# EAGLE design Servitor32 (EAGLE 6.1)
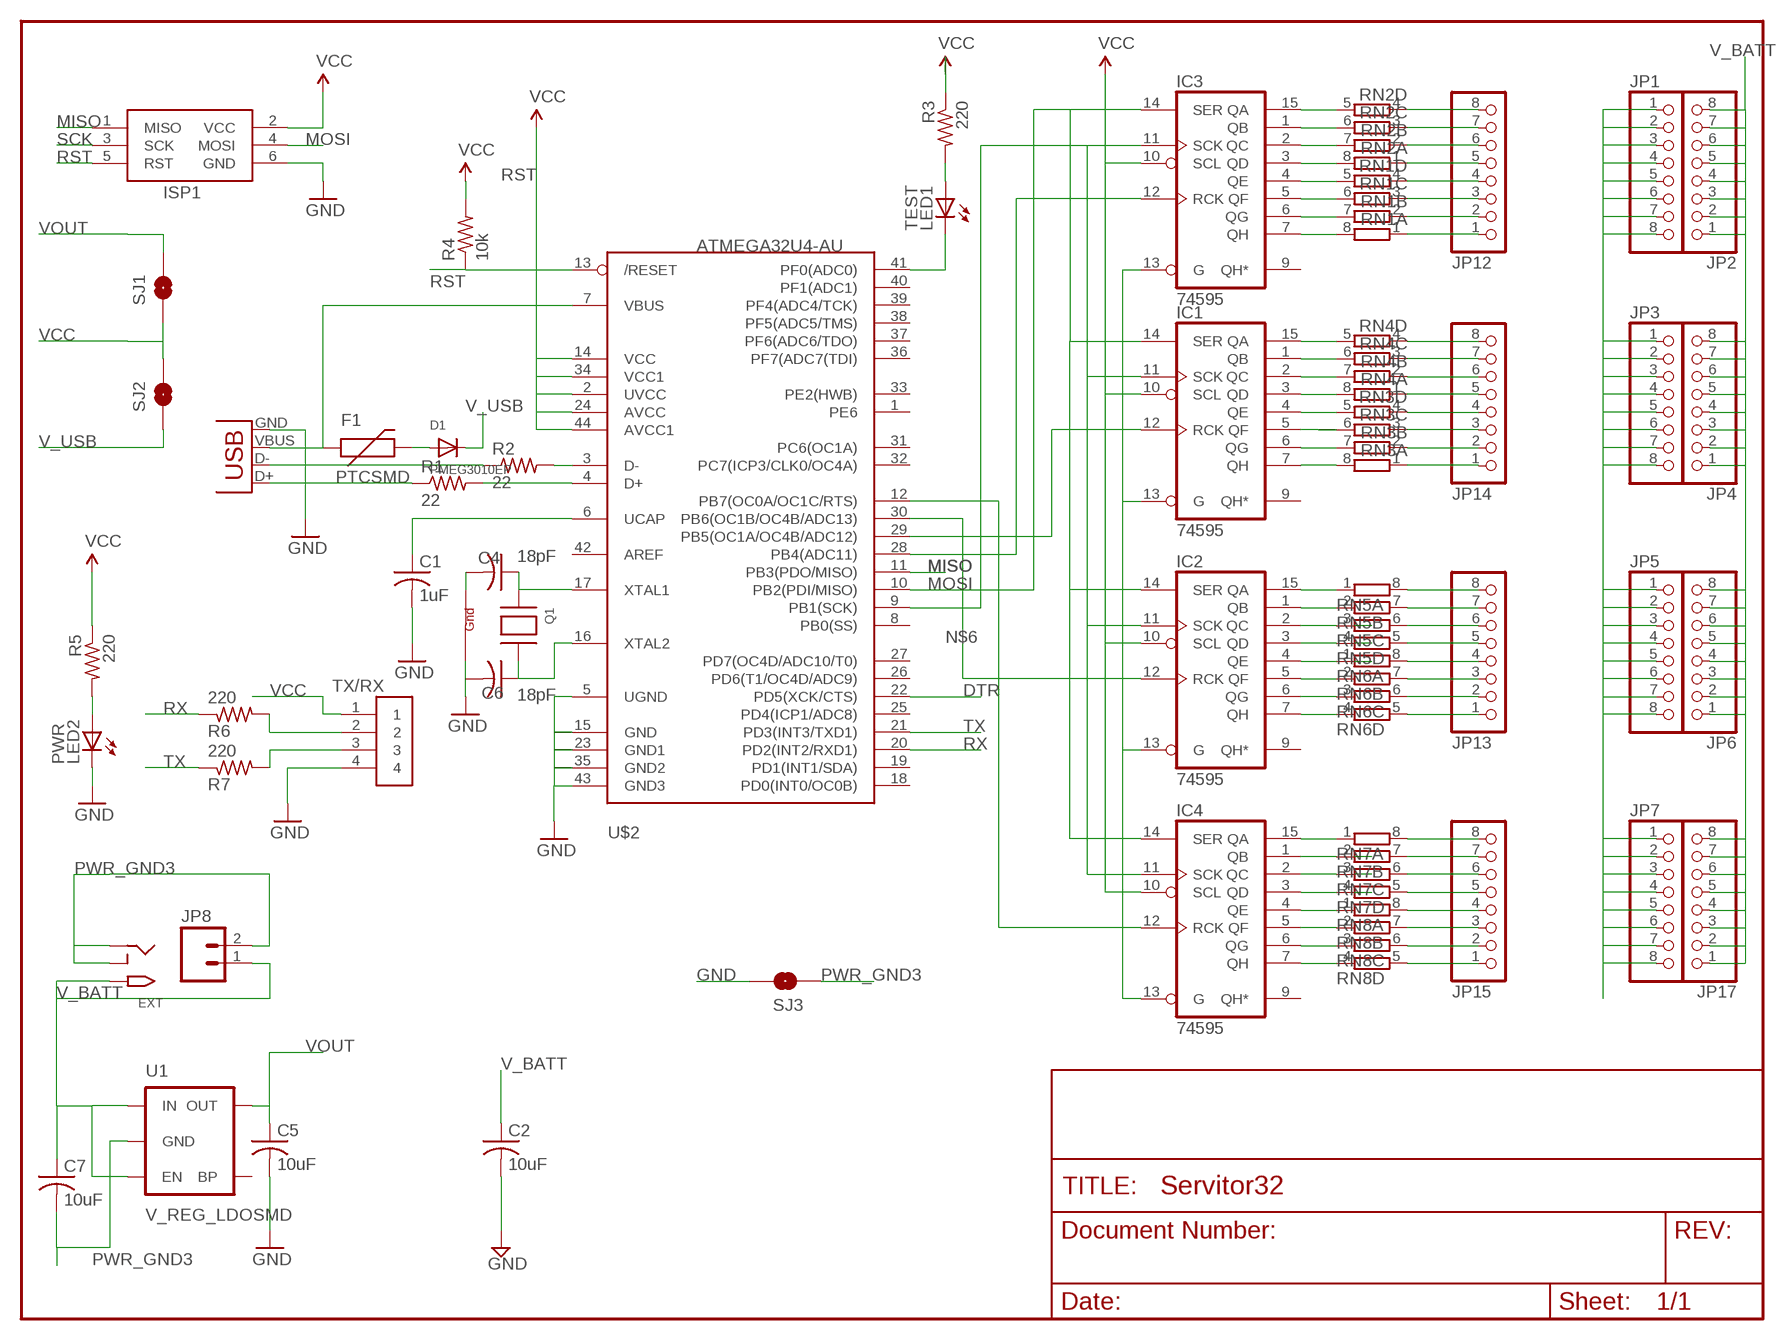
[diagram p0: schematic, sheet 1]

## Parts
C1  1uF  C-USC0805K  [C0805K]
C2  10uF  C-USC0805K  [C0805K]
C4  18pF  C-USC0805K  [C0805K]
C5  10uF  C-USC0805K  [C0805K]
C6  18pF  C-USC0805K  [C0805K]
C7  10uF  C-USC0805  [C0805]
D1  PMEG3010EP  [SOD-128]
EXT  2.1MMJACKTHM  [PJ-102A]
F1  PTCSMD  [PTC-1206]
IC1  74595  [TSSOP16]
IC2  74595  [TSSOP16]
IC3  74595  [TSSOP16]
IC4  74595  [TSSOP16]
ISP1  AVRISP-6  [AVRISP]
JP1  PINHD-1X8CLEANBIG  [1X08-CLEANBIG]
JP2  PINHD-1X8CLEANBIG  [1X08-CLEANBIG]
JP3  PINHD-1X8CLEANBIG  [1X08-CLEANBIG]
JP4  PINHD-1X8CLEANBIG  [1X08-CLEANBIG]
JP5  PINHD-1X8CLEANBIG  [1X08-CLEANBIG]
JP6  PINHD-1X8CLEANBIG  [1X08-CLEANBIG]
JP7  PINHD-1X8CLEANBIG  [1X08-CLEANBIG]
JP8  M023.5MM  [SCREWTERMINAL-3.5MM-2]
JP12  PINHD-1X8CLEANBIG  [1X08-CLEANBIG]
JP13  PINHD-1X8CLEANBIG  [1X08-CLEANBIG]
JP14  PINHD-1X8CLEANBIG  [1X08-CLEANBIG]
JP15  PINHD-1X8CLEANBIG  [1X08-CLEANBIG]
JP17  PINHD-1X8CLEANBIG  [1X08-CLEANBIG]
LED1  TEST  LEDSML0805  [SML0805]
LED2  PWR  LEDSML0805  [SML0805]
Q1  XTAL-4-3225  [NX3225]
R1  22  R-US_R0805  [R0805]
R2  22  R-US_R0805  [R0805]
R3  220  R-US_R0805  [R0805]
R4  10k  R-US_R0805  [R0805]
R5  220  R-US_R0805  [R0805]
R6  220  R-US_R0805  [R0805]
R7  220  R-US_R0805  [R0805]
RN1  4R-NEXB38V  [EXB38V]
RN2  4R-NEXB38V  [EXB38V]
RN3  4R-NEXB38V  [EXB38V]
RN4  4R-NEXB38V  [EXB38V]
RN5  4R-NEXB38V  [EXB38V]
RN6  4R-NEXB38V  [EXB38V]
RN7  4R-NEXB38V  [EXB38V]
RN8  4R-NEXB38V  [EXB38V]
SJ1  SOLDERJUMPER-OLDTRACE  [SJ_2S-TRACE]
SJ2  SOLDERJUMPER-OLDTRACE  [SJ_2S-TRACE]
SJ3  SOLDERJUMPER-OLDTRACE  [SJ_2S-TRACE]
TX/RX  TX/RX  1X4-BIG  [1X04-BIG]
U1  V_REG_LDOSMD  [SOT23-5]
U$2  ATMEGA32U4-AU  [TQFP44]
X1  USBSMD  [USB-MINIB]

## Nets
D+: R1.1 X1.D+
D-: R2.1 X1.D-
DTR: U$2.22(PD5(XCK/CTS))
GND: C1.2 C5.2 C6.2 ISP1.6(GND) LED2.C Q1.4(G2) SJ3.2 TX/RX.4 U$2.5(UGND) U$2.15(GND) U$2.23(GND1) U$2.35(GND2) U$2.43(GND3) X1.GND
MISO: ISP1.1(MISO) U$2.11(PB3(PDO/MISO))
MOSI: IC1.14(SER) IC2.14(SER) IC3.14(SER) IC4.14(SER) ISP1.4(MOSI) U$2.10(PB2(PDI/MISO))
N$1: IC3.15(QA) RN2.5
N$2: LED2.A R5.2
N$3: C4.1 Q1.1(X1) U$2.17(XTAL1)
N$4: R2.2 U$2.3(D-)
N$5: R1.2 U$2.4(D+)
N$6: LED1.C U$2.41(PF0(ADC0))
N$7: LED1.A R3.2
N$8: C4.2 Q1.2(G1)
N$9: C6.1 Q1.3(X2) U$2.16(XTAL2)
N$10: D1.P$2(A) F1.2
N$11: IC3.1(QB) RN2.6
N$12: IC1.15(QA) RN4.5
N$13: IC3.2(QC) RN2.7
N$14: IC3.3(QD) RN2.8
N$16: C1.1 U$2.6(UCAP)
N$17: IC3.4(QE) RN1.5
N$18: IC3.5(QF) RN1.6
N$19: IC3.6(QG) RN1.7
N$20: IC3.7(QH) RN1.8
N$21: JP12.8 RN2.4
N$22: JP12.7 RN2.3
N$23: JP12.6 RN2.2
N$24: JP12.5 RN2.1
N$25: JP12.4 RN1.4
N$26: JP12.3 RN1.3
N$27: JP12.2 RN1.2
N$28: IC1.1(QB) RN4.6
N$29: IC1.2(QC) RN4.7
N$30: IC1.3(QD) RN4.8
N$31: IC1.4(QE) RN3.5
N$32: IC1.5(QF) RN3.6
N$33: IC1.6(QG) RN3.7
N$34: IC1.7(QH) RN3.8
N$35: IC2.15(QA) RN5.1
N$36: IC2.1(QB) RN5.2
N$37: IC2.3(QD) RN5.4
N$38: IC2.4(QE) RN6.1
N$39: IC2.5(QF) RN6.2
N$40: IC2.6(QG) RN6.3
N$41: IC2.7(QH) RN6.4
N$42: IC4.7(QH) RN8.4
N$43: IC4.15(QA) RN7.1
N$44: IC4.2(QC) RN7.3
N$45: IC4.3(QD) RN7.4
N$46: IC4.4(QE) RN8.1
N$47: IC4.5(QF) RN8.2
N$48: IC4.6(QG) RN8.3
N$49: IC2.2(QC) RN5.3
N$50: IC4.1(QB) RN7.2
N$51: JP12.1 RN1.1
N$52: JP14.8 RN4.4
N$53: JP14.7 RN4.3
N$54: JP14.6 RN4.2
N$55: JP14.5 RN4.1
N$57: JP14.4 RN3.4
N$58: JP14.3 RN3.3
N$59: JP14.2 RN3.2
N$60: JP13.8 RN5.8
N$61: JP13.7 RN5.7
N$62: JP13.5 RN5.5
N$63: JP13.4 RN6.8
N$64: JP13.3 RN6.7
N$65: JP13.2 RN6.6
N$66: JP13.1 RN6.5
N$67: JP15.1 RN8.5
N$68: JP15.8 RN7.8
N$69: JP15.6 RN7.6
N$70: JP15.5 RN7.5
N$71: JP15.4 RN8.8
N$72: JP15.3 RN8.7
N$73: JP15.2 RN8.6
N$74: JP13.6 RN5.6
N$75: JP15.7 RN7.7
N$76: JP14.1 RN3.1
N$90: R7.2 TX/RX.3
N$91: R6.2 TX/RX.2
PB4: IC3.12(RCK) U$2.28(PB4(ADC11))
PB5: IC1.12(RCK) U$2.29(PB5(OC1A/OC4B/ADC12))
PB6: IC2.12(RCK) U$2.30(PB6(OC1B/OC4B/ADC13))
PB7: IC4.12(RCK) U$2.12(PB7(OC0A/OC1C/RTS))
PWR_GND3: C2.2 C7.2 EXT.RING EXT.RING_SW IC1.13(G) IC2.13(G) IC3.13(G) IC4.13(G) JP1.1 JP1.2 JP1.3 JP1.4 JP1.5 JP1.6 JP1.7 JP1.8 JP3.1 JP3.2 JP3.3 JP3.4 JP3.5 JP3.6 JP3.7 JP3.8 JP5.1 JP5.2 JP5.3 JP5.4 JP5.5 JP5.6 JP5.7 JP5.8 JP7.1 JP7.2 JP7.3 JP7.4 JP7.5 JP7.6 JP7.7 JP7.8 JP8.2 SJ3.1 U1.2(GND) ; supply symbol labelled GND
RST: ISP1.5(RST) R4.1 U$2.13(/RESET)
RX: R6.1 U$2.20(PD2(INT2/RXD1))
SCK: IC1.11(SCK) IC2.11(SCK) IC3.11(SCK) IC4.11(SCK) ISP1.3(SCK) U$2.9(PB1(SCK))
TX: R7.1 U$2.21(PD3(INT3/TXD1))
V_BATT: C2.1 C7.1 EXT.TIP JP2.1 JP2.2 JP2.3 JP2.4 JP2.5 JP2.6 JP2.7 JP2.8 JP4.1 JP4.2 JP4.3 JP4.4 JP4.5 JP4.6 JP4.7 JP4.8 JP6.1 JP6.2 JP6.3 JP6.4 JP6.5 JP6.6 JP6.7 JP6.8 JP8.1 JP17.1 JP17.2 JP17.3 JP17.4 JP17.5 JP17.6 JP17.7 JP17.8 U1.1(IN) U1.3(EN)
V_USB: D1.P$1(C) SJ2.1
VBUS: F1.1 U$2.7(VBUS) X1.VBUS
VCC: IC1.10(SCL) IC2.10(SCL) IC3.10(SCL) IC4.10(SCL) ISP1.2(VCC) R3.1 R4.2 R5.1 SJ1.1 SJ2.2 TX/RX.1 U$2.2(UVCC) U$2.14(VCC) U$2.24(AVCC) U$2.34(VCC1) U$2.44(AVCC1)
VOUT: C5.1 SJ1.2 U1.5(OUT)
Unconnected: IC1.9(QH*) IC2.9(QH*) IC3.9(QH*) IC4.9(QH*) U1.4(BP) U$2.1(PE6) U$2.8(PB0(SS)) U$2.18(PD0(INT0/OC0B)) U$2.19(PD1(INT1/SDA)) U$2.25(PD4(ICP1/ADC8)) U$2.26(PD6(T1/OC4D/ADC9)) U$2.27(PD7(OC4D/ADC10/T0)) U$2.31(PC6(OC1A)) U$2.32(PC7(ICP3/CLK0/OC4A)) U$2.33(PE2(HWB)) U$2.36(PF7(ADC7(TDI)) U$2.37(PF6(ADC6/TDO)) U$2.38(PF5(ADC5/TMS)) U$2.39(PF4(ADC4/TCK)) U$2.40(PF1(ADC1)) U$2.42(AREF)

## Power pins joined to a net without a drawn wire
GND: IC1.8(GND) IC2.8(GND) IC3.8(GND) IC4.8(GND)
VCC: IC1.16(VCC) IC2.16(VCC) IC3.16(VCC) IC4.16(VCC)

## Library data of the parts
C1 C2 C4-C7 = rcl:C-US: CAPACITOR, American symbol
D1 = arcbotics:PMEG3010EP
EXT = adafruit:2.1MMJACK: 2.1mm x 5.5mm THM DC jack with internal switch. Digikey part #PJ-102A, 4UCON part #05537 2.1mm x 5.5mm SMT DC jack with internal switch. Digikey part #PJ-002A-SMT, 4UCON part #03267 By microbuilder.eu & adafruit.com
F1 = SparkFun:PTC: Resettable Fuse PTC Resettable Fuse. Spark Fun Electronics SKU : COM-08357
IC1-IC4 = arcbotics:74*595: 8-bit SHIFT REGISTER, output latch
ISP1 = adafruit:AVRISP: AVR ISP HEADER Standard 6 pin header for AVR programming
JP1-JP7 JP12-JP15 JP17 = adafruit:PINHD-1X8: PIN HEADER
JP8 = SparkFun:M02: Header 2 Standard 2-pin 0.1" header. Use with straight break away headers (SKU : PRT-00116), right angle break away headers (PRT-00553), swiss pins (PRT-00743), machine pins (PRT-00117), and female headers (PRT-00115). Molex polarized connector foot print use with SKU : PRT-08233 with associated crimp pins and housings.
LED1 LED2 = led:LED: LED OSRAM: - CHIPLED LG R971, LG N971, LY N971, LG Q971, LY Q971, LO R971, LY R971 LH N974, LH R974 LS Q976, LO Q976, LY Q976 LO Q996 - Hyper CHIPLED LW Q18S LB Q993, LB Q99A, LB R99A - SideLED LS A670, LO A670, LY A670, LG A670, LP A670 LB A673, LV A673, LT A673, LW A673 LH A674 LY A675 LS A676, LA A676, LO A676, LY A676, LW A676 LS A679, LY A679, LG A679 - Hyper Micro SIDELED® LS Y876, LA Y876, LO Y876, LY Y876 LT Y87S - SmartLED LW L88C, LW L88S LB L89C, LB L89S, LG L890 LS L89K, LO L89K, LY L89K LS L896, LA L896, LO L896, LY L896 - TOPLED LS T670, LO T670, LY T670, LG T670, LP T670 LSG T670, LSP T670, LSY T670, LOP T670, LYG T670 LG T671, LOG T671, LSG T671 LB T673, LV T673, LT T673, LW T673 LH T674 LS T676, LA T676, LO T676, LY T676, LB T676, LH T676, LSB T676, LW T676 LB T67C, LV T67C, LT T67C, LS T67K, LO T67K, LY T67K, LW E67C LS E67B, LA E67B, LO E67B, LY E67B, LB E67C, LV E67C, LT E67C LW T67C LS T679, LY T679, LG T679 LS T770, LO T770, LY T770, LG T770, LP T770 LB T773, LV T773, LT T773, LW T773 LH T774 LS E675, LA E675, LY E675, LS T675 LS T776, LA T776, LO T776, LY T776, LB T776 LHGB T686 LT T68C, LB T68C - Hyper Mini TOPLED® LB M676 - Mini TOPLED Santana® LG M470 LS M47K, LO M47K, LY M47K Source: http://www.osram.convergy.de LUXEON: - LUMILED® LXK2-PW12-R00, LXK2-PW12-S00, LXK2-PW14-U00, LXK2-PW14-V00 LXK2-PM12-R00, LXK2-PM12-S00, LXK2-PM14-U00 LXK2-PE12-Q00, LXK2-PE12-R00, LXK2-PE12-S00, LXK2-PE14-T00, LXK2-PE14-U00 LXK2-PB12-K00, LXK2-PB12-L00, LXK2-PB12-M00, LXK2-PB14-N00, LXK2-PB14-P00, LXK2-PB14-Q00 LXK2-PR12-L00, LXK2-PR12-M00, LXK2-PR14-Q00, LXK2-PR14-R00 LXK2-PD12-Q00, LXK2-PD12-R00, LXK2-PD12-S00 LXK2-PH12-R00, LXK2-PH12-S00 LXK2-PL12-P00, LXK2-PL12-Q00, LXK2-PL12-R00 Source: www.luxeon.com KINGBRIGHT: KA-3528ASYC Source: www.kingbright.com
Q1 = adafruit:XTAL-4: Classic 4-pin 3.2 x 2.5mm crystal
R1 R2 R4 = rcl:R-US_: RESISTOR, American symbol
R3 R5-R7 = resistor:R-US_: RESISTOR, American symbol
RN1-RN8 = resistor-dil:4R-N: Array Chip Resistor Source: RS Component / Phycomp; OC_FARNELL: unknown; OC_NEWARK: unknown
SJ1-SJ3 = SparkFun:SOLDERJUMPER-OLD: Solder Jumper Standard SMD solder jumper. Used to automate production. Two varients : Normally Open and Normally Closed are the same, but have different paste layers. NC will have a large amount of paste and should jumper during reflow.
TX/RX = adafruit:1X4: 4-pin connector
U1 = SparkFun:V_REG_LDO: Voltage Regulator LDO Standard 150mA LDO voltage regulator in SOT-23 layout. Micrel part MIC5205. BP (by-pass) pin is used to lower output noise with 470pF cap.
U$2 = adafruit:ATMEGA32U4: http://www.ladyada.net/library/eagle
X1 = SparkFun:USB: USB Connectors USB-B-PTH is fully proven SKU : PRT-00139 USB-miniB is fully proven SKU : PRT-00587 USB-A-PCB is untested. USB-A-H is throughly reviewed, but untested. Spark Fun Electronics SKU : PRT-00437 USB-B-SMT is throughly reviewed, but untested. Needs silkscreen touching up. USB-A-S has not been used/tested USB-MB-H has not been used/tested

## Board
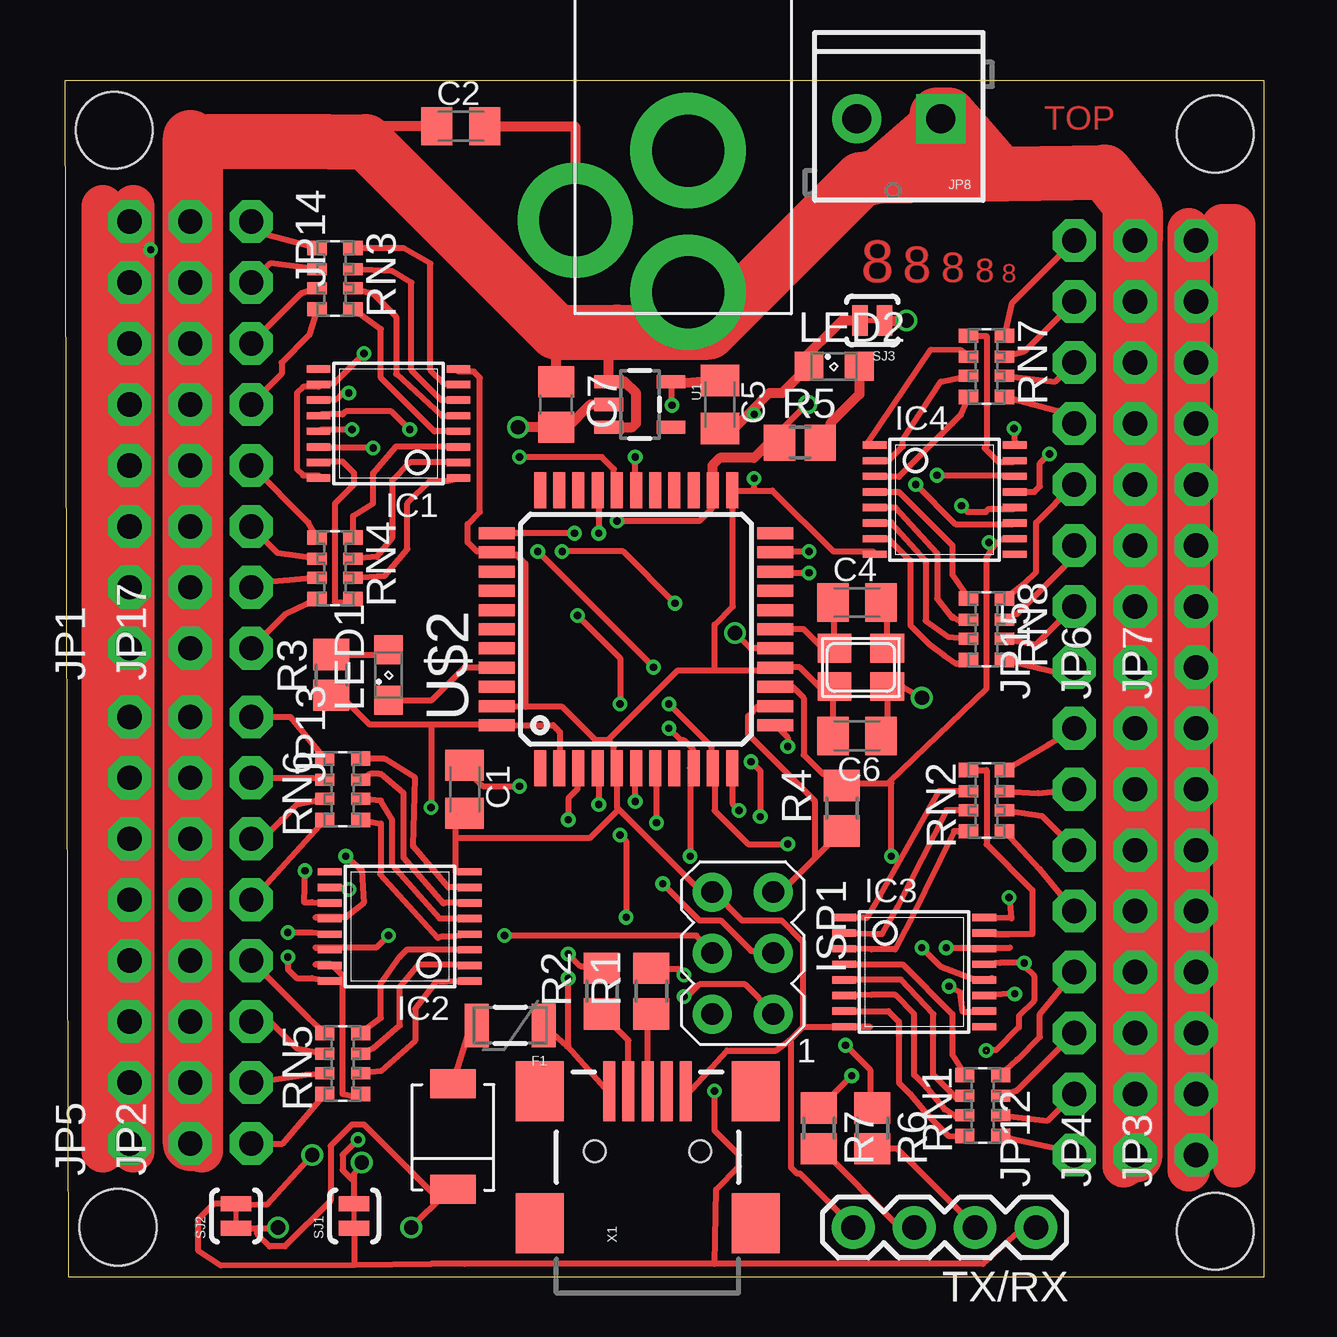
[diagram p1: board, top side]
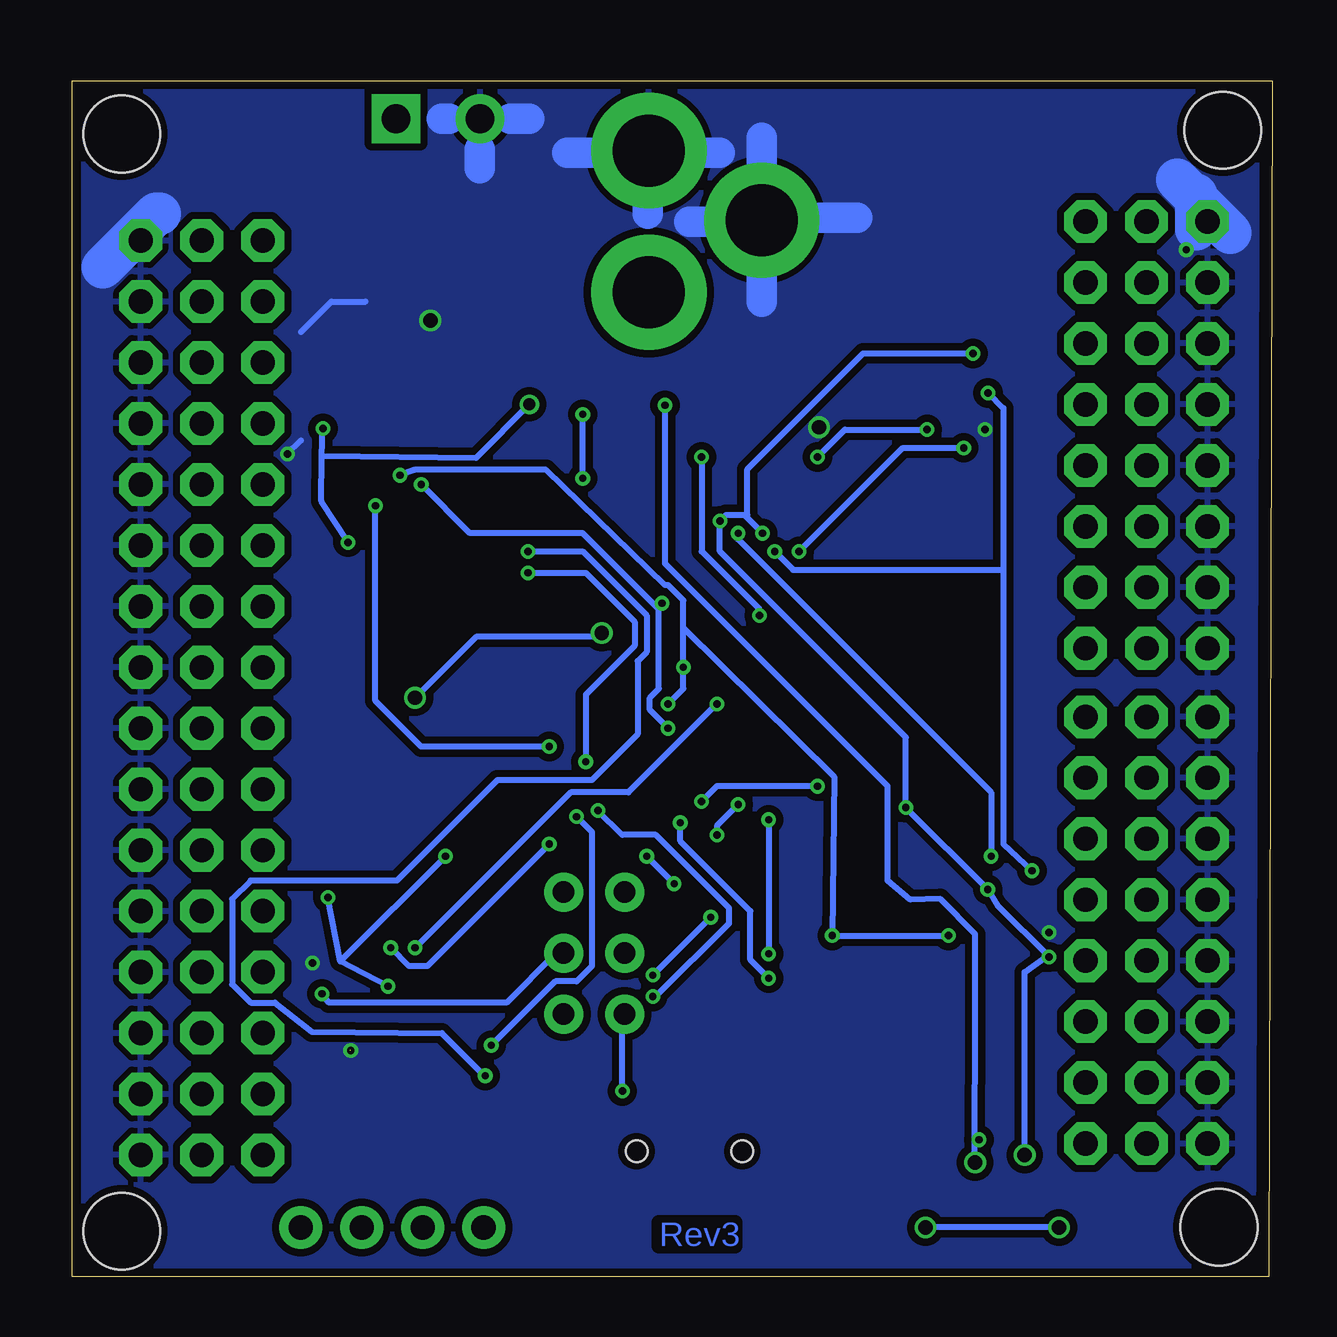
[diagram p2: board, bottom side, seen from below]

Size 49.99 x 49.84 mm. Coordinates in mm from the lower left corner, seen from the top.
Outline: 0.16,0 49.99,0 49.99,49.84 0,49.84 0.16,0
Copper layers (1*16): Top 0.035mm / dielectric 1.5mm / Bottom 0.035mm
Design rules: minimum track width 10mil, minimum drill 12mil, track to track 7mil, track to pad 7mil, pad to pad 7mil, via to via 7mil, smd to smd 0mil, copper to edge 10mil, drill to drill 10mil, minimum pad ring 10mil, minimum via ring 6mil, stop-mask expansion 2mil, vias tented up to drill 100mil, thermal gap 10mil
Holes 3.2 mm at 2.06,47.78 2.22,2.06 47.94,47.62 47.94,1.91

### Footprints (pad centres in the part's own frame; a part is rotated, then mirrored left to right if it is on the bottom)
C0805K = smd 1.3 x 1.6: 1 -1,0; 2 1,0
C0805 = smd 1.3 x 1.5: 1 -0.95,0; 2 0.95,0
SOD-128 = smd 1.2 x 1.9: P$1 -2.223,0.016; P$2 2.179,0.016
PJ-102A = drill 3 pad 4.8: RING 0.1,-3.39; RING_SW -4.6,-6.29; TIP 0.1,-9.29
PTC-1206 = smd 1 x 1.8: 1 -1.4,0; 2 1.4,0
TSSOP16 = smd 0.305 x 0.991: 1 -2.275,-2.918; 2 -1.625,-2.918; 3 -0.975,-2.918; 4 -0.325,-2.918; 5 0.325,-2.918; 6 0.975,-2.918; 7 1.625,-2.918; 8 2.275,-2.918; 9 2.275,2.918; 10 1.625,2.918; 11 0.975,2.918; 12 0.325,2.918; 13 -0.325,2.918; 14 -0.975,2.918; 15 -1.625,2.918; 16 -2.275,2.918
AVRISP = drill 0.9 pad 1.626: 1 -1.27,2.54; 2 1.27,2.54; 3 -1.27,0; 4 1.27,0; 5 -1.27,-2.54; 6 1.27,-2.54
1X08-CLEANBIG = drill 1.016 pad 1.778 octagon: 1 -8.89,0; 2 -6.35,0; 3 -3.81,0; 4 -1.27,0; 5 1.27,0; 6 3.81,0; 7 6.35,0; 8 8.89,0
SCREWTERMINAL-3.5MM-2 = drill 1.2 pad 2.032 square: 1 0,0 | drill 1.2 pad 2.032: 2 3.5,0
SML0805 = smd 1.2 x 1.2: A 1.05,0; C -1.05,0
NX3225 = smd 1.4 x 1.2: 1 -1.1,0.8; 2 1.1,0.8; 3 1.1,-0.8; 4 -1.1,-0.8
R0805 = smd 1.3 x 1.5: 1 -0.95,0; 2 0.95,0
R0805' = smd 1.3 x 1.5: 1 -0.85,0; 2 0.85,0
EXB38V = smd 0.6 x 0.8: 1 -1.275,-0.75; 4 1.275,-0.75; 5 1.275,0.75; 8 -1.275,0.75 | smd 0.5 x 0.8: 2 -0.4,-0.75; 3 0.4,-0.75; 6 0.4,0.75; 7 -0.4,0.75
SJ_2S-TRACE = smd 0.635 x 1.27: 1 -0.508,0; 2 0.508,0
1X04-BIG = drill 1.016 pad 1.778: 1 0,0; 2 2.54,0; 3 5.08,0; 4 7.62,0
SOT23-5 = smd 0.55 x 1.2: 1 -0.95,-1.3; 2 0,-1.3; 3 0.95,-1.3; 4 0.95,1.3; 5 -0.95,1.3
TQFP44 = smd 1.5 x 0.5: 1 -5.8,4; 2 -5.8,3.2; 3 -5.8,2.4; 4 -5.8,1.6; 5 -5.8,0.8; 6 -5.8,0; 7 -5.8,-0.8; 8 -5.8,-1.6; 9 -5.8,-2.4; 10 -5.8,-3.2; 11 -5.8,-4; 23 5.8,-4; 24 5.8,-3.2; 25 5.8,-2.4; 26 5.8,-1.6; 27 5.8,-0.8; 28 5.8,0; 29 5.8,0.8; 30 5.8,1.6; 31 5.8,2.4; 32 5.8,3.2; 33 5.8,4 | smd 0.5 x 1.5: 12 -4,-5.8; 13 -3.2,-5.8; 14 -2.4,-5.8; 15 -1.6,-5.8; 16 -0.8,-5.8; 17 0,-5.8; 18 0.8,-5.8; 19 1.6,-5.8; 20 2.4,-5.8; 21 3.2,-5.8; 22 4,-5.8; 34 4,5.8; 35 3.2,5.8; 36 2.4,5.8; 37 1.6,5.8; 38 0.8,5.8; 39 0,5.8; 40 -0.8,5.8; 41 -1.6,5.8; 42 -2.4,5.8; 43 -3.2,5.8; 44 -4,5.8
USB-MINIB = smd 2.5 x 0.5: D+ 2.5,0; D- 2.5,0.8; GND 2.5,-1.6; ID 2.5,-0.8; VBUS 2.5,1.6 | smd 2.5 x 2: MTN1 -3,4.5; MTN2 2.5,4.5; MTN3 -3,-4.5; MTN4 2.5,-4.5 | hole 0.9: 0,2.2; 0,-2.2

### Placement (x,y rotation side)
C1  16.67,20.32 270 top
C2  16.51,47.94 0 top
C4  33.02,28.1 0 top
C5  27.3,36.35 270 top
C6  33.02,22.54 180 top
C7  20.48,36.35 270 top
D1  16.19,5.87 90 top
EXT  25.88,50.32 0 top
F1  18.57,10.48 180 top
IC1  13.49,35.56 90 top
IC2  13.97,14.61 90 top
IC3  35.4,12.7 270 top
IC4  36.67,32.38 270 top
ISP1  28.26,13.49 180 top
JP1  2.7,35.08 90 top
JP2  5.24,14.45 90 top
JP3  47.15,13.97 90 top
JP4  44.61,13.97 90 top
JP5  2.7,14.45 90 top
JP6  44.61,34.29 90 top
JP7  47.15,34.29 90 top
JP8  36.51,48.26 180 top
JP12  42.07,13.97 90 top
JP13  7.78,14.45 270 top
JP14  7.78,35.08 270 top
JP15  42.07,34.29 90 top
JP17  5.24,35.08 90 top
LED1  13.49,25.08 90 top
LED2  32.07,37.94 0 top
Q1  33.18,25.4 0 top
R1  24.45,11.91 90 top
R2  22.38,11.91 90 top
R3  220  [R0805']  11.11,25.08 90 top
R4  32.38,19.53 90 top
R5  220  [R0805']  30.64,34.77 0 top
R6  220  [R0805']  33.66,6.19 270 top
R7  220  [R0805']  31.43,6.19 270 top
RN1  38.26,7.14 90 top
RN2  38.42,19.84 90 top
RN3  11.27,41.59 270 top
RN4  11.27,29.53 270 top
RN5  11.59,8.89 90 top
RN6  11.59,20.32 90 top
RN7  38.42,37.94 270 top
RN8  38.42,26.99 270 top
SJ1  12.06,2.54 90 top
SJ2  7.14,2.54 90 top
SJ3  33.66,39.85 180 top
TX/RX  40.48,2.06 180 top
U1  23.97,36.35 270 top
U$2  23.81,26.99 90 top
X1  24.29,5.24 90 top

### Tracks (layer width: path | path; a pad name or v marks a point on that pad's centre or on a via)
D+
  Top 0.254: X1.D+ 24.29,10.8 R1.1
D-
  Top 0.254: X1.D- 23.49,9.85 R2.1
GND  (via drill 0.3)
  Top 0.254: C6.2 32.02,24.54 Q1.4 31.44,24.6 30.64,25.4 29.62,25.4 U$2.15 29.5,25.27 27.08,25.27 | 30.77,10.41 33.56,10.41 IC3.8 | 30.19,9.84 29.62,9.43 27.59,9.43 25.94,7.62 X1.GND | 30.19,9.84 30.77,10.41 | TX/RX.4 32.8,2.16 30.64,4.32 30.51,4.32 30.26,4.57 30.26,9.78 30.19,9.84 | 30.77,38.23 30.89,38.1 LED2.C | 28.73,32.77 27.84,32.77 U$2.23 27.84,32.64 27.84,27.94 27.08,27.18 27.08,25.27 | 28.73,32.77 29.5,32.77 32.04,30.23 33.69,30.23 IC4.8 | 28.73,32.77 v28.73,33.27 | v28.73,35.94 28.61,36.07 | IC1.8 16.41,37.72 17.05,37.72 17.3,37.47 17.3,31.88 16.8,31.37 16.8,30.61 17.18,30.23 17.94,30.23 U$2.35 18.07,30.1 18.83,30.1 19.21,29.72 19.21,23.75 | 16.29,18.29 16.29,18.92 16.67,19.3 C1.2 | 16.29,18.29 16.29,16.89 IC2.8 | 23.08,19.49 26.45,16.13 26.96,16.13 ISP1.6 27.08,16 28.23,14.86 29.88,14.86 30.77,13.97 30.77,10.41 | 23.08,19.49 23.02,19.56 23.02,21.08 U$2.5 22.89,21.21 22.89,22.1 22.64,22.35 | 19.21,23.75 20.73,23.75 22.13,22.35 22.64,22.35 | 19.21,23.75 18.07,23.75 U$2.43 | 16.29,18.29 21.88,18.29 23.02,19.43 23.08,19.49 | 27.08,25.27 25.56,25.27 22.64,22.35 | 32.29,39.75 32.17,39.63
  Top 0.406: 32.17,39.63 30.77,38.23 30.64,38.1 | C5.2 27.73,35.2 28.61,36.07 29.37,36.83 29.91,36.83 LED2.C | SJ3.2 32.38,39.85 32.29,39.75 32.23,39.69
  Bottom 0.254: v28.73,33.27 v28.73,35.94
MISO  (via drill 0.3)
  Top 0.254: v28.1,19.43 27.84,19.68 27.84,21.08 U$2.11 | v25.81,11.68 25.94,11.68 26.45,12.19 28.35,12.19 29.5,11.05 ISP1.1
  Bottom 0.254: v28.1,19.43 27.08,18.41 25.69,18.41 22.64,15.37 22.64,14.73 25.69,11.68 v25.81,11.68
MOSI  (via drill 0.3)
  Top 0.254: v13.49,14.22 12.99,13.72 10.45,13.72 IC2.14 | v18.34,14.22 26.32,14.22 26.96,13.59 ISP1.4 | v12.86,34.54 10.7,34.54 IC1.14 | v24.54,25.4 v19.72,30.23 | v25.18,23.88 26.96,22.1 26.96,21.21 U$2.10 27.08,21.08 27.08,19.43 28.48,18.03 v30.13,18.03 | v36.73,13.72 39.4,13.72 IC3.14 | v36.35,33.4 39.53,33.4 IC4.14
  Bottom 0.254: v13.49,14.22 v18.34,14.22 18.26,20.84 24.54,27.05 | v12.86,34.54 15.4,34.54 v19.72,30.23 | v25.18,23.88 24.54,24.51 v24.54,25.4 24.54,27.05 | v36.73,13.72 35.97,12.95 35.21,12.95 v30.13,18.03 | v36.35,33.4 35.73,33.62 30.26,33.62 25.3,28.83 25.18,28.83 24.54,28.19 24.54,27.05
N$1
  Top 0.254: RN2.5 37.78,21.11 38.42,21.11 38.42,18.02 40.32,16.11 40.32,14.29 38.73,14.29 39.39,14.29 IC3.15
N$2
  Top 0.254: R5.2 31.53,34.8 31.78,34.8 31.91,34.8
  Top 0.406: LED2.A 33.12,36.77 31.91,35.56 31.91,34.8 31.91,34.29
N$3
  Top 0.254: C4.1 32.08,28.04 Q1.1 31.58,26.2 30.8,26.99 U$2.17
N$4  (via drill 0.3)
  Top 0.254: v20.99,13.46 21.49,12.95 22.38,12.95 R2.2 | v20.99,19.05 20.99,19.94 21.37,20.32 21.37,21.08 U$2.3
  Bottom 0.254: v20.99,19.05 v20.99,13.46
N$5  (via drill 0.3)
  Top 0.254: v25.81,12.57 25.56,12.83 24.54,12.83 R1.2 | v23.4,14.99 23.4,18.16 v23.15,18.41 | v22.26,19.68 22.26,21.08 U$2.4
  Bottom 0.254: v23.4,14.99 v25.81,12.57 | v23.15,18.41 23.15,18.8 v22.26,19.68
N$6
  Top 0.254: LED1.C 15.3,24.03 16.67,25.4 17.94,25.4 U$2.41
N$7
  Top 0.254: R3.2 13.07,25.93 13.33,26.19 13.37,26.16 13.49,26.16 LED1.A
N$8
  Top 0.254: Q1.2 34.28,27.84 C4.2
N$9  (via drill 0.6)
  Top 0.254: C6.1 34.28,22.8 Q1.3 34.92,24.6 v35.72,24.13 | U$2.16 28.58,26.19 v27.94,26.83
  Bottom 0.254: v35.72,24.13 33.18,26.67 28.1,26.67 27.97,26.8 v27.94,26.83
N$10
  Top 0.254: D1.P$2 16.81,10.12 F1.2
N$11
  Top 0.254: RN2.6 36.43,20.24 33.97,15.88 33.42,14.96 IC3.1
N$12
  Top 0.254: RN4.5 12.06,28.26 11.59,28.1 11.27,28.1 11.27,32.23 12.06,33.02 12.06,33.5 11.59,33.97 10.61,33.97 IC1.15
N$13
  Top 0.254: RN2.7 36.75,19.45 34.69,15.4 34.37,14.84 34.05,14.29 33.63,14.29 IC3.2
N$14
  Top 0.254: RN2.8 37.22,18.57 37.07,18.57 35.24,14.84 34.61,13.65 33.62,13.65 IC3.3
N$16  (via drill 0.3)
  Top 0.254: v23.78,19.81 23.78,21.08 U$2.6 | v18.95,20.45 17.43,20.45 16.67,21.21 C1.1
  Bottom 0.254: v23.78,19.81 23.15,20.45 v18.95,20.45
N$17
  Top 0.254: IC3.4 34.92,13.03 36.99,10.95 36.99,9.25 RN1.5
N$18
  Top 0.254: RN1.6 37.15,7.46 36.19,8.41 36.19,10.95 34.85,12.38 33.67,12.38 IC3.5
N$19
  Top 0.254: RN1.7 37.15,6.67 36.67,6.99 35.88,7.94 35.4,8.41 35.4,10.95 34.61,11.75 33.62,11.75 IC3.6
N$20
  Top 0.254: IC3.7 34.33,11.07 34.77,10.64 34.77,8.1 35.24,7.62 36.04,6.67 36.83,5.87 RN1.8
N$21
  Top 0.254: RN2.4 41,22.18 JP12.8
N$22
  Top 0.254: RN2.3 40.56,20.16 JP12.7
N$23
  Top 0.254: RN2.2 40.72,19.21 42.07,17.86 JP12.6
N$24
  Top 0.254: RN2.1 40.64,16.99 JP12.5
N$25
  Top 0.254: RN1.4 39.69,9.05 40.64,10 40.64,10.95 JP12.4
N$26
  Top 0.254: RN1.3 39.69,7.78 JP12.3
N$27
  Top 0.254: RN1.2 40.96,6.51 JP12.2
N$28
  Top 0.254: RN4.6 13.33,29.21 14.29,30.32 14.29,32.23 15.24,33.18 15.99,33.18 IC1.1
N$29
  Top 0.254: IC1.2 14.41,33.94 13.65,33.18 13.65,30.8 13.02,30 RN4.7
N$30
  Top 0.254: RN4.8 12.02,31.71 12.86,32.23 12.86,33.5 13.81,34.61 16.28,34.61 IC1.3
N$31
  Top 0.254: IC1.4 15.41,35.23 13.18,37.47 13.18,39.49 RN3.5
N$32
  Top 0.254: RN3.6 12.86,40.96 13.81,40.01 13.81,37.62 15.72,35.88 16.25,35.88 IC1.5
N$33
  Top 0.254: IC1.6 15.69,36.53 14.45,37.78 14.45,41.43 13.65,41.91 RN3.7
N$34
  Top 0.254: IC1.7 15.84,37.19 15.24,37.78 15.24,42.23 14.13,42.86 RN3.8
N$35
  Top 0.254: RN5.1 12.22,7.46 11.59,7.62 11.59,12.54 11.11,13.02 10.45,13.02 IC2.15
N$36
  Top 0.254: IC2.1 15.46,12.28 14.6,11.17 14.6,9.84 13.18,8.57 RN5.2
N$37
  Top 0.254: RN5.4 13.18,10.79 13.18,12.22 13.97,13.34 14.29,13.65 16.23,13.65 IC2.3
N$38
  Top 0.254: RN6.1 13.18,18.89 13.18,16.87 13.13,16.79 15.56,14.13 15.78,14.19 16.16,14.19 IC2.4
N$39
  Top 0.254: IC2.5 15.63,14.93 13.65,17.14 13.65,19.05 13.18,19.84 RN6.2
N$40
  Top 0.254: IC2.6 15.85,15.58 15.8,15.56 14.13,17.46 14.13,20.16 13.18,20.95 13.11,20.95 12.73,20.95 RN6.3
N$41
  Top 0.254: IC2.7 16,16.23 14.53,17.94 14.6,20.8 13.33,21.59 RN6.4
N$42
  Top 0.254: IC4.7 34.33,30.76 35.24,29.84 35.24,29.69 35.24,27.15 36.04,26.35 36.67,25.88 37.15,25.56 37.19,25.56 RN8.4
N$43
  Top 0.254: RN7.1 37.78,39.21 38.42,39.21 38.42,34.61 38.39,34.54 38.35,34.51 | IC4.15 39.55,33.97 38.89,33.97 38.35,34.51 | 38.35,34.51 38.34,34.53
N$44
  Top 0.254: IC4.2 34.33,34.01 34.92,34.61 34.92,34.88 36.51,37.31 RN7.3
N$45
  Top 0.254: RN7.4 37.35,35.92 36.99,35.56 34.77,33.34 33.78,33.34 IC4.3
N$46
  Top 0.254: IC4.4 34.76,32.71 36.99,30.48 36.99,29.25 RN8.1
N$47
  Top 0.254: IC4.5 34.61,32.06 36.35,30.16 36.35,28.26 36.96,27.5 | 36.96,27.5 36.99,27.46 | RN8.2 37.24,27.37 36.99,27.53 36.96,27.5
N$48
  Top 0.254: IC4.6 34.15,31.41 34.29,31.41 34.45,31.43 35.88,29.84 35.88,27.35 36.83,26.67 RN8.3
N$49
  Top 0.254: RN5.3 12.86,9.53 13.97,10.48 13.97,12.06 14.76,13.02 15.72,13.02 16.22,13.02 IC2.2
N$50
  Top 0.254: IC4.1 33.44,34.71 36.08,38.62 37.37,38.61 RN7.2
N$51
  Top 0.254: RN1.1 41.91,5.24 JP12.1
N$52
  Top 0.254: RN4.4 9.21,27.62 JP14.8
N$53
  Top 0.254: RN4.3 7.94,28.89 JP14.7
N$54
  Top 0.254: RN4.2 8.89,30.16 JP14.6
N$55
  Top 0.254: RN4.1 10.16,31.43 JP14.5
N$57
  Top 0.254: RN3.4 10.2,39.25 9.05,38.1 9.05,37.62 JP14.4
N$58
  Top 0.254: RN3.3 9.84,40.96 JP14.3
N$59
  Top 0.254: RN3.2 8.57,42.23 JP14.2
N$60
  Top 0.254: JP13.8 9.09,5.56 RN5.8
N$61
  Top 0.254: JP13.7 10.04,8.41 RN5.7
N$62
  Top 0.254: RN5.5 10.16,10.79 JP13.5
N$63
  Top 0.254: JP13.4 7.82,15.72 RN6.8
N$64
  Top 0.254: JP13.3 8.25,18.26 9.05,19.05 9.68,19.68 RN6.7
N$65
  Top 0.254: JP13.2 10.36,20.8 RN6.6
N$66
  Top 0.254: JP13.1 9.41,23.34 RN6.5
N$67
  Top 0.254: RN8.5 41.75,25.08 JP15.1
N$68
  Top 0.254: RN7.8 39.49,40.6 JP15.8
N$69
  Top 0.254: RN7.6 41.27,37.31 JP15.6
N$70
  Top 0.254: RN7.5 41.59,36.04 JP15.5
N$71
  Top 0.254: RN8.8 40,28.89 40.48,29.37 40.48,31.43 JP15.4
N$72
  Top 0.254: RN8.7 39.69,27.62 40.8,28.73 41.43,29.37 41.91,29.84 41.94,29.84 41.94,30.35 JP15.3
N$73
  Top 0.254: RN8.6 40.48,26.35 JP15.2
N$74
  Top 0.254: JP13.6 8.57,10.64 9.05,10.16 9.68,9.53 RN5.6
N$75
  Top 0.254: RN7.7 40,38.58 JP15.7
N$76
  Top 0.254: RN3.1 8.1,43.5 7.78,43.81 7.78,43.94 JP14.1
N$87  (via drill 0.6)
  Bottom 0.254: v8.89,2.06 v14.45,2.06
N$90
  Top 0.254: R7.2 31.53,5.33 34.7,2.16 35.34,2.16 TX/RX.3
N$91
  Top 0.254: R6.2 33.69,5.33 34.7,5.33 37.88,2.16 TX/RX.2
PB4  (via drill 0.3)
  Top 0.254: 38.37,12.37 38.64,12.45 38.28,12.42 | 38.28,12.42 37.89,12.4 36.48,12.95 v35.72,13.72 | v23.15,23.88 23.15,25.78 v21.37,27.56 | v23.78,34.16 23.78,32.89 U$2.28 | IC3.12 38.28,12.42
  Bottom 0.254: v35.72,13.72 29.24,20.19 26.83,20.19 v23.15,23.88 | v21.37,27.56 21.37,27.81 23.78,30.23 v23.78,34.16
PB5  (via drill 0.3)
  Top 0.254: v14.38,35.31 13.62,36.07 11.72,36.07 11.59,35.94 10.7,35.94 IC1.12 | v18.95,34.16 22.38,34.16 22.89,33.66 22.89,32.89 U$2.29
  Bottom 0.254: v14.38,35.31 17.81,35.31 v18.95,34.16
PB6  (via drill 0.3)
  Top 0.254: v11.72,17.53 12.38,16.94 12.46,15.57 11.72,14.99 10.45,14.99 IC2.12 | v22.26,30.99 22.26,32.77 U$2.30
  Bottom 0.254: v11.72,17.53 11.72,20.19 22.26,30.73 v22.26,30.99
PB7  (via drill 0.3)
  Top 0.254: v37.37,32.13 37.62,31.88 38.39,31.88 38.51,32 39.53,32 IC4.12 | v30.13,22.1 30.13,22.48 29.62,22.99 U$2.12
  Bottom 0.254: v37.37,32.13 37.37,24 35.46,22.1 v30.13,22.1
PWR_GND3  (via drill 0.3, 0.6)  (1 unrouted)
  Top 0.254: 1.59,25.02 2.06,25.02 2.86,25.02 | v9.3,14.35 10.32,14.35 IC2.13 | v11.97,35.31 10.7,35.31 IC1.13 | IC3.13 38.97,13.08 v39.99,13.08 39.99,12.95 40.4,12.54 40.4,11.51 39.77,10.87 39.77,10.4 38.81,9.45 38.42,9.45 | U1.2 22.64,36.32 22.64,36.35 | JP3.8 46.83,22.86 | 1.05,12.06 1.59,12.06 | 48.26,43.81 47.66,43.81 JP7.8 | v3.59,42.8 2.86,42.8 | IC4.13 40.41,32.71 40.64,32.94 40.64,33.89 v41.04,34.29
  Top 0.406: v18.89,35.4 C7.2 20.96,35.4 21.91,36.35 22.64,36.35 U1.2 22.86,36.35 | C2.2 21.28,47.94 EXT.RING_SW | SJ3.1 v35.08,39.85
  Top 1.778: 1.59,44.61 1.59,25.02 1.59,12.06 1.59,5.24 | 2.86,44.61 2.86,42.8 2.86,25.02 2.86,5.24 | 48.26,43.81 48.74,43.81 48.74,4.6 | 46.83,43.66 46.83,22.86 46.83,4.45
  Bottom 0.254: 3.17,44.32 3.21,44.32 JP1.8 | v3.59,42.8 3.59,42.93 3.17,43.66 | v41.04,34.29 40.48,34.85 | 40.48,39.37 39.21,40.64 37.78,40.64
  Bottom 1.27: 17.3,44.13 19.21,44.13 | 21.27,46.04 21.27,47.47 | 21.27,40.64 21.27,42.07 | 24.29,43.97 23.34,43.97 | 28.1,46.83 29.37,46.83 | 23.97,46.83 23.02,46.83 | 26.03,44.77 26.03,44.29 | 30.96,48.26 31.75,48.26 | 33.02,46.2 33.02,46.99 | 34.61,48.26 34.29,48.26
  Bottom 1.778: 3.97,45.72 1.75,43.5 | 3.17,45.09 3.17,44.32 3.17,43.66 | 46.35,44.29 46.51,44.29 48.74,42.07
  other vias: 38.4,9.43
  pour Bottom (isolate 0.305): 0.64,49.37 49.53,49.37 49.53,0.48 0.79,0.48
RST
  Top 0.254: ISP1.5 29.84,16.03 31.3,17.5 | 31.3,17.5 R4.1 | U$2.13 29.5,23.75 28.86,23.75 28.48,23.37 28.48,22.61 31.27,19.81 31.27,17.53 31.3,17.5
RX  (via drill 0.3)
  Top 0.254: v32.54,9.65 33.56,8.64 33.56,7.11 R6.1 | v28.99,19.18 28.99,21.08 v28.61,21.46 | v31.02,29.34 29.62,29.34 U$2.20
  Bottom 0.254: v32.54,9.65 29.88,12.32 28.99,12.32 28.35,12.95 28.35,18.54 v28.99,19.18 | v28.61,21.46 28.61,24.26 26.57,26.29 26.57,27.3 28.61,29.34 v31.02,29.34
S$1  (via drill 0.6)
  other vias: 12.38,4.76
SCK  (via drill 0.3)
  Top 0.254: v10.02,16.92 9.97,15.62 10.32,15.62 IC2.11 | v11.84,36.83 11.59,36.83 11.33,36.58 10.7,36.58 IC1.11 | v39.59,11.79 39.53,11.73 39.53,11.81 IC3.11 | v35.46,33.02 37.12,31.37 39.53,31.37 IC4.11 | v25.18,22.86 25.69,22.35 25.81,22.35 26.19,21.97 26.19,21.21 U$2.9 26.07,21.21 v26.07,17.53 | v24.92,16.38 26.45,14.86 27.34,14.86 28.61,13.59 29.5,13.59 ISP1.3 | v20.73,30.23 23.27,30.23 v25.43,28.07
  Bottom 0.254: v10.02,16.92 11.21,18.03 11.21,29.46 | 11.21,29.46 11.21,36.2 v11.84,36.83 | v39.59,11.79 39.31,11.43 31.91,11.43 29.88,13.46 29.62,13.46 ISP1.3 | v35.46,33.02 33.43,30.99 28.73,30.99 25.62,27.88 | 25.62,27.88 25.56,27.81 25.56,24.51 25.94,24.13 25.94,23.62 v25.18,22.86 | v26.07,17.53 v24.92,16.38 | 11.21,29.46 19.97,29.46 v20.73,30.23 | v25.43,28.07 25.56,27.94 25.62,27.88
TX  (via drill 0.3)
  Top 0.254: v32.8,8.38 31.53,7.11 R7.1 | v31.02,30.23 29.62,30.23 U$2.21
  Bottom 0.254: v32.8,8.38 32.83,8.38 34.61,10.16 40.02,10.21 41.56,11.43 42.58,11.43 43.34,12.19 43.34,15.75 42.58,16.51 36.48,16.51 32.29,20.7 28.35,20.7 26.45,22.61 26.45,25.65 26.07,26.04 26.07,27.56 28.73,30.23 v31.02,30.23
V_BATT
  Top 0.254: JP2.2 5.24,8.13 5.71,8.13 | 5.75,26.04 5.71,26.04 | 5.75,26.04 JP17.1 5.75,26.04 | JP2.3 5.24,10.67 5.71,10.67 | JP2.4 5.24,13.21 5.71,13.21 | JP2.5 5.24,15.75 5.71,15.75 | JP2.6 5.24,18.29 5.71,18.29 | JP2.7 5.24,20.83 5.71,20.83 | JP2.8 5.24,23.37 5.71,23.37 | JP17.2 5.24,28.83 5.71,28.83 | JP17.3 5.24,31.37 5.71,31.37 | JP17.4 5.24,33.91 5.71,33.91 | JP17.5 5.24,36.45 5.71,36.45 | JP17.6 5.24,38.99 5.71,38.99 | JP17.7 5.24,41.53 5.71,41.53 | 5.75,26.04 5.24,26.04 | 23.34,37.31 23.15,37.21 22.76,37.21 U1.1 | 44.13,24.64 44.23,24.64 JP6.1 | 37.59,47.54 37.24,47.24 36.5,48.09 | 7.02,47.31 6.38,47.37 5.71,46.83 | JP4.2 44.13,7.62 | JP4.3 44.13,10.16 | JP4.4 44.13,12.7 | JP4.5 44.13,15.24 | JP4.6 44.13,17.78 | JP4.7 44.13,20.32 | JP4.8 44.13,22.86 | JP6.2 44.13,27.94 | JP6.3 44.13,30.48 | JP6.4 44.13,33.02 | JP6.5 44.13,35.56 | JP6.6 44.13,38.1 | JP6.7 44.13,40.64 | JP17.8 5.24,44.07 5.71,44.07 | EXT.TIP 26.07,41.02 26.07,40.39 26.07,39.37
  Top 0.406: 12.86,47.94 12.86,46.99 | C7.1 20.48,39.37 | U1.1 22.67,39.02 23.02,39.37 | U1.3 23.66,35.4 23.81,35.56 23.81,36.83 23.34,37.31 | C2.1 13.02,47.94 13.02,46.83
  Top 1.778: 5.71,46.83 5.71,44.07 5.71,41.53 5.71,38.99 5.71,36.45 5.71,33.91 5.71,31.37 5.71,28.83 5.71,26.04 5.71,23.37 5.71,20.83 5.71,18.29 5.71,15.75 5.71,13.21 5.71,10.67 5.71,8.13 5.71,5.24 | 43.5,45.4 44.13,44.61 44.13,40.64 44.13,38.1 44.13,35.56 44.13,33.02 44.13,30.48 44.13,27.94 44.13,24.64 44.13,22.86 44.13,20.32 44.13,17.78 44.13,15.24 44.13,12.7 44.13,10.16 44.13,7.62 44.13,4.6
  Top 2.286: JP2.1 JP2.2 5.24,8.13 JP2.3 5.24,10.67 JP2.4 5.24,13.21 JP2.5 5.24,15.75 JP2.6 5.24,18.29 JP2.7 5.24,20.83 JP2.8 5.24,23.37 5.24,26.04 JP17.1 JP17.2 5.24,28.83 JP17.3 5.24,31.37 JP17.4 5.24,33.91 JP17.5 5.24,36.45 JP17.6 5.24,38.99 JP17.7 5.24,41.53 JP17.8 5.24,44.07 5.24,47.47 5.24,44.93 | JP4.1 JP4.2 JP4.3 JP4.4 JP4.5 JP4.6 JP4.7 JP4.8 JP6.1 JP6.2 JP6.3 JP6.4 JP6.5 JP6.6 JP6.7 JP6.8 44.61,44.45 43.34,46.04 33.97,45.88 | 6.03,47.31 7.02,47.31 10.95,47.31 12.54,47.31 12.86,46.99 13.02,46.83 20.48,39.37 23.02,39.37 26.07,39.37 26.83,39.37 27.21,39.75 29.37,41.91 30.64,43.18 33.18,45.72 33.97,45.88 | JP8.1 36.51,48.1 36.5,48.09 33.97,45.88 | 36.35,48.42 36.83,48.42 37.59,47.54 38.89,46.04
  Bottom 0.254: 5.24,43.94 JP17.8
V_USB
  Top 0.254: SJ2.1 8.03,2.03 | 8.03,2.03 8.86,2.03 8.89,2.06 | 14.45,2.06 15.87,3.49 D1.P$1 15.53,3.3 12.48,6.35 11.97,6.35 11.08,5.46 11.08,3.17 9.18,1.27 8.54,1.27 8.03,1.78 8.03,2.03
VBUS  (via drill 0.3)
  Top 0.254: X1.VBUS 22.69,7.66 20.93,9.61 | 20.93,9.61 F1.1 | v24.67,18.92 24.67,21.08 U$2.7 | v20.99,12.45 20.99,9.65 20.93,9.61
  Bottom 0.254: v24.67,18.92 24.67,18.16 21.75,15.24 21.75,13.21 v20.99,12.45
VCC  (via drill 0.3, 0.5, 0.6)
  Top 0.254: R3.1 11.49,24.23 12.7,23.02 15.27,23.02 | 15.27,23.02 17.98,23.02 U$2.44 20.35,22.99 20.48,22.86 20.64,22.7 20.64,21.21 U$2.2 | U$2.14 30.34,24.59 30.8,24.13 30.8,21.75 31.59,20.95 31.91,20.95 R4.2 32.42,20.57 34.32,20.57 34.39,20.64 | IC1.16 10.57,33.4 9.94,33.4 9.68,33.66 9.68,36.83 9.94,37.08 10.57,37.08 IC1.10 10.7,37.21 11.21,37.21 v12.48,38.48 | v21.24,30.99 18.07,30.99 U$2.34 | v23.02,31.5 26.45,31.5 26.96,32 26.96,32.64 U$2.24 | 38.7,30.42 38.42,29.97 38.42,24.51 34.39,20.64 | 38.7,30.42 39.02,30.73 39.53,30.73 IC4.10 | v39.56,35.35 39.66,35.18 39.58,35.1 IC4.16 | v38.51,30.61 38.64,30.48 38.7,30.42 | v9.3,13.34 9.3,12.83 9.68,12.45 10.32,12.45 IC2.16 | v11.86,16.14 11.87,16.21 11.24,16.21 IC2.10 | v15.27,19.56 15.27,22.99 15.27,23.02 | 38.29,11.13 IC3.10 38.39,11.05 | 40.42,2.16 TX/RX.1 40.16,2.29 38.26,0.54 27.08,0.54 | v39.35,15.81 39.45,14.94 IC3.16 | v36.85,12.11 37.32,11.86 37.42,11.05 38.39,11.05 | 27.08,0.54 16.67,0.54 15.27,0.54 12.07,0.5 | 27.08,0.54 27.15,3.65 28.1,4.6 28.1,5.08 27.08,6.1 v27.08,7.75 | v34.45,17.53 34.45,20.57 34.39,20.64 | SJ2.2 8.41,3.02 v10.32,5.08 | SJ2.2 7.21,3.05 SJ2.2 | SJ2.2 6.22,3.05 5.56,2.38 5.56,1.11 6.51,0.48 12.07,0.5 | SJ1.1 12.07,0.5 | v30.96,36.35 30.89,36.32 29.5,34.92 R5.1 | 38.58,11.11 38.51,11.05 38.48,11.05 | 38.39,11.05 38.48,11.05 | 38.48,11.05 38.5,11.03
  Top 0.406: R5.1 29.37,34.77 28.73,34.13 27.3,34.13 26.99,33.81 26.99,32.81 U$2.24
  Bottom 0.254: 21.94,31.69 22,31.75 22.76,31.75 v23.02,31.5 23.02,30.23 15.27,22.48 v15.27,19.56 v11.86,16.14 11.46,15.49 v9.3,13.34 9.43,13.34 10.32,12.7 v10.32,5.08 | 21.94,31.69 v21.24,30.99 | v12.48,38.48 17.05,38.48 21.88,33.66 21.88,31.75 21.94,31.69 | 39.61,34.21 39.62,32.32 v38.51,30.61 | 39.61,34.21 v39.56,35.35 | v36.85,12.11 38.83,13.14 | 38.83,13.14 v39.35,15.81 | v27.08,7.75 27.08,10.92 ISP1.2 | v34.45,17.53 38.77,13.21 38.83,13.14 | 39.61,34.21 33.18,34.13 v30.96,36.35
VOUT  (via drill 0.3)
  Top 0.254: v25.3,36.32 25.3,37.08 U1.5 | SJ1.2 12.06,4.06 | 12.06,4.06 12.06,4.29 12.38,4.76 | v12.22,5.71 11.59,5.08 11.59,4.45 11.97,4.06 12.06,4.06
  Top 0.406: C5.1 25.38,37.2 U1.5
  Bottom 0.254: v25.3,36.32 25.3,29.72 16.03,20.45 16.03,16.51 15.08,15.72 13.84,15.75 12.38,14.29 12.38,13.02 12.38,10.32 12.41,5.71 | 12.41,4.73 12.41,5.71 | v12.22,5.71 12.35,5.71 12.41,5.71

### Text on the board
Top: TOP | 8 | 8 | 8 | 8 | 8
Bottom: Rev3